# EAGLE schematic Irrig_schematic (EAGLE 6.2)
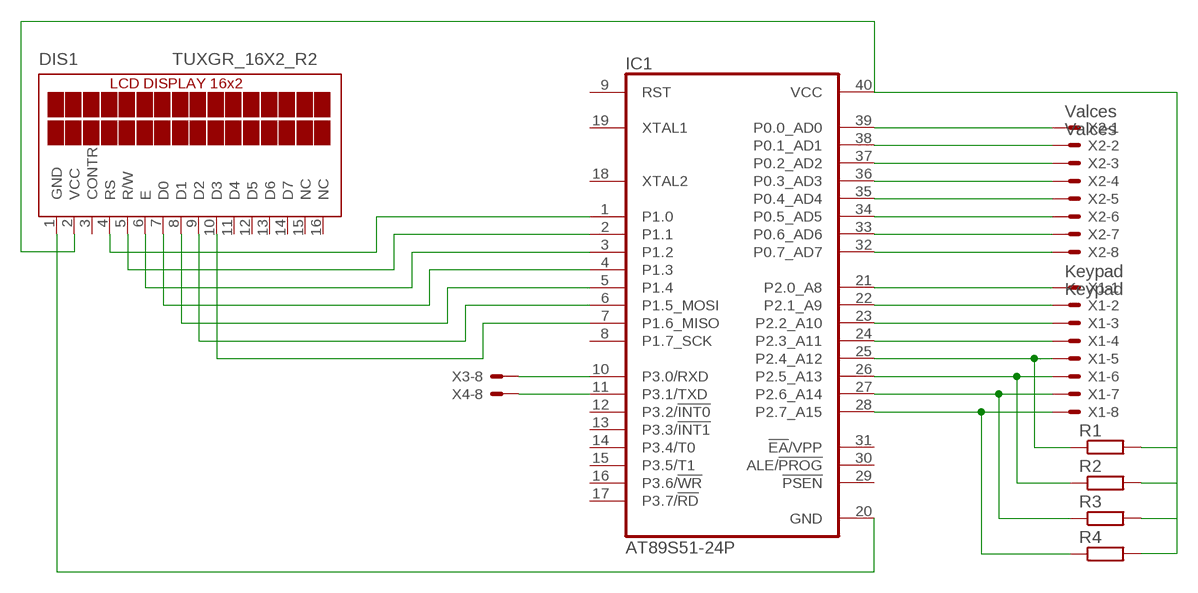
[diagram p0: schematic, sheet 1]

## Parts
DIS1  TUXGR_16X2_R2  [TUXGR_16X2_R2]
IC1  AT89S51-24P  [DIL40]
R1  R-EU_0204/5  [0204/5]
R2  R-EU_0204/5  [0204/5]
R3  R-EU_0204/5  [0204/5]
R4  R-EU_0204/5  [0204/5]
X1  Keypad  332-16  [332-16]
X2  Valces  332-16  [332-16]
X3  Motor  332-16  [332-16]
X4  Motor  332-16  [332-16]

## Nets
N$1: IC1.21(P2.0_A8) X1.1
N$2: IC1.22(P2.1_A9) X1.2
N$3: IC1.23(P2.2_A10) X1.3
N$4: IC1.24(P2.3_A11) X1.4
N$5: IC1.25(P2.4_A12) R1.1 X1.5
N$6: IC1.26(P2.5_A13) R2.1 X1.6
N$7: IC1.27(P2.6_A14) R3.1 X1.7
N$8: IC1.28(P2.7_A15) R4.1 X1.8
N$9: DIS1.4(RS) IC1.1(P1.0)
N$10: DIS1.5(R/W) IC1.2(P1.1)
N$11: DIS1.6(E) IC1.3(P1.2)
N$12: DIS1.7(D0) IC1.4(P1.3)
N$13: DIS1.8(D1) IC1.5(P1.4)
N$14: DIS1.9(D2) IC1.6(P1.5_MOSI)
N$15: DIS1.10(D3) IC1.7(P1.6_MISO)
N$16: DIS1.2(VCC) IC1.40(VCC) R1.2 R2.2 R3.2 R4.2
N$17: IC1.39(P0.0_AD0) X2.1
N$18: IC1.38(P0.1_AD1) X2.2
N$19: IC1.37(P0.2_AD2) X2.3
N$20: IC1.36(P0.3_AD3) X2.4
N$21: IC1.35(P0.4_AD4) X2.5
N$22: IC1.34(P0.5_AD5) X2.6
N$23: IC1.33(P0.6_AD6) X2.7
N$24: IC1.32(P0.7_AD7) X2.8
N$25: IC1.10(P3.0/RXD) X3.8
N$26: IC1.11(P3.1/TXD) X4.8
N$28: DIS1.1(GND) IC1.20(GND)
Unconnected: DIS1.3(CONTR) DIS1.11(D4) DIS1.12(D5) DIS1.13(D6) DIS1.14(D7) DIS1.15(NC) DIS1.16(NC) IC1.8(P1.7_SCK) IC1.9(RST) IC1.12(P3.2/!INT0) IC1.13(P3.3/!INT1) IC1.14(P3.4/T0) IC1.15(P3.5/T1) IC1.16(P3.6/!WR) IC1.17(P3.7/!RD) IC1.18(XTAL2) IC1.19(XTAL1) IC1.29(!PSEN) IC1.30(ALE/!PROG) IC1.31(!EA!/VPP) X1.9 X1.10 X1.11 X1.12 X1.13 X1.14 X1.15 X1.16 X2.9 X2.10 X2.11 X2.12 X2.13 X2.14 X2.15 X2.16 X3.1 X3.2 X3.3 X3.4 X3.5 X3.6 X3.7 X3.9 X3.10 X3.11 X3.12 X3.13 X3.14 X3.15 X3.16 X4.1 X4.2 X4.3 X4.4 X4.5 X4.6 X4.7 X4.9 X4.10 X4.11 X4.12 X4.13 X4.14 X4.15 X4.16

## Library data of the parts
DIS1 = display-lcd:TUXGR_16X2_R2: Tuxgraphics LCD display 16x2 characters reflective, without background light Source: tuxgr_12x2_r2.pdf; OC_FARNELL: unknown; OC_NEWARK: unknown
IC1 = atmel:AT89S51-*: 8-bit Microcontroller with 4K BytesIn-System Programmable Flash Source: http://www.atmel.com/dyn/resources/prod_documents/doc2487.pdf; MPN: AT89S51-24PU; OC_FARNELL: 1095739; OC_NEWARK: 96K6578
R1-R4 = rcl:R-EU_: RESISTOR, European symbol
X1-X4 = con-garry:332-16: 16 Pin - 2mm Dual Row Source: www.mpe-connector.de / garry_shortform_2012.pdf